# Altium schematic sheet LPEDT_revA1_bikeit_MCU_PINS.SchDoc: MCU I/O Port Pins
size A3; Author: Dhruva Koley; DocumentNumber: 8; Revision: 1; SheetNumber: 7; SheetTotal: 11
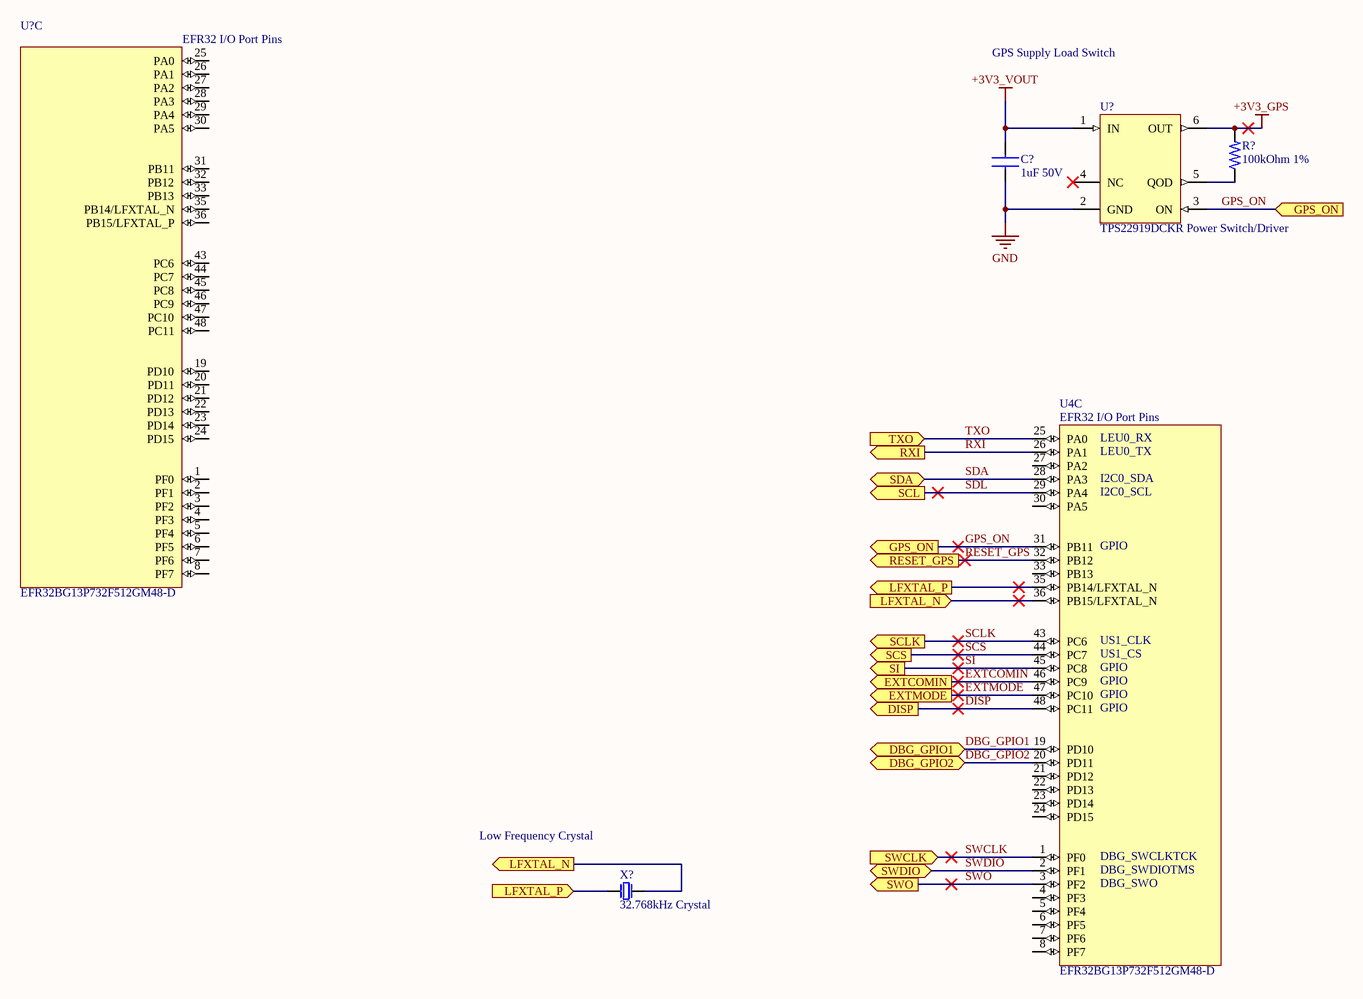
[diagram p0: LPEDT_revA1_bikeit_MCU_PINS.SchDoc]

## Parts
(Parts that share a designator on the sheet are numbered #1, #2 ... from top to bottom, then left to right.)
C?  1uF 50V  [CAP_0603_1.60mm*0.80mm]
R?  100kOhm 1%  [RES_0603_1608X06]
U4  EFR32BG13P732F512GM48-D  [QFN50P700X700X90_HS-49N]  (part C of 3)
U?#1  TPS22919DCKR Power Switch/Driver
U?#2  EFR32BG13P732F512GM48-D  [QFN50P700X700X90_HS-49N]  (part C of 3)
X?  32.768kHz Crystal

## Ports
DBG_GPIO1 (bidir), DBG_GPIO2 (bidir), DISP (out), EXTCOMIN (out), EXTMODE (out), GPS_ON (in), GPS_ON (out), LFXTAL_N (in), LFXTAL_N (out), LFXTAL_P (in), LFXTAL_P (out), RESET_GPS (out), RXI (out), SCL (out), SCLK (out), SCS (out), SDA (bidir), SI (out), SWCLK (in), SWDIO (bidir), SWO (out), TXO (in)

## Nets
+3V3_GPS: R?.2 U?#1.6(OUT)
+3V3_VOUT: C?.1 U?#1.1(IN)
GND: C?.2 U?#1.2(GND)
DBG_GPIO1: U4.19(PD10) ; port DBG_GPIO1
DBG_GPIO2: U4.20(PD11) ; port DBG_GPIO2
DISP: U4.48(PC11) ; port DISP
EXTCOMIN: U4.46(PC9) ; port EXTCOMIN
EXTMODE: U4.47(PC10) ; port EXTMODE
GPS_ON: U4.31(PB11) U?#1.3(ON) ; port GPS_ON
LFXTAL_N: U4.36(PB15/LFXTAL_N) X?.2 ; port LFXTAL_N
LFXTAL_P: U4.35(PB14/LFXTAL_N) X?.1 ; port LFXTAL_P
RESET_GPS: U4.32(PB12) ; port RESET_GPS
RXI: U4.26(PA1) ; port RXI
SCLK: U4.43(PC6) ; port SCLK
SCS: U4.44(PC7) ; port SCS
SDA: U4.28(PA3) ; port SDA
SDL: U4.29(PA4) ; port SCL
SI: U4.45(PC8) ; port SI
SWCLK: U4.1(PF0) ; port SWCLK
SWDIO: U4.2(PF1) ; port SWDIO
SWO: U4.3(PF2) ; port SWO
TXO: U4.25(PA0) ; port TXO
NetR?_1: R?.1 U?#1.5(QOD)

Not connected (* = marked no-connect by the designer): U4 4(PF3) 5(PF4) 6(PF5) 7(PF6) 8(PF7) 21(PD12) 22(PD13) 23(PD14) 24(PD15) 27(PA2) 30(PA5) 33(PB13); U?#1 4(NC)*; U?#2 1(PF0) 2(PF1) 3(PF2) 4(PF3) 5(PF4) 6(PF5) 7(PF6) 8(PF7) 19(PD10) 20(PD11) 21(PD12) 22(PD13) 23(PD14) 24(PD15) 25(PA0) 26(PA1) 27(PA2) 28(PA3) 29(PA4) 30(PA5) 31(PB11) 32(PB12) 33(PB13) 35(PB14/LFXTAL_N) 36(PB15/LFXTAL_P) 43(PC6) 44(PC7) 45(PC8) 46(PC9) 47(PC10) 48(PC11)

## Notes on the sheet
- GPS Supply Load Switch
- (near U4) LEU0_RX
- (near U4) LEU0_TX
- (near U4) I2C0_SDA
- (near U4) I2C0_SCL
- (near U4) GPIO
- (near U4) US1_CLK
- (near U4) US1_CS
- (near X?) Low Frequency Crystal
- (near U4) DBG_SWCLKTCK
- (near U4) DBG_SWDIOTMS
- (near U4) DBG_SWO
- (in symbol EFR32BG13P732F512GM48-D, part C) EFR32 I/O Port Pins

## Library data of the parts
C? = GRT188R61H105KE13D: CAP, MLCC, AEC-Q200, X5R, 1uF, 50V, 0603; Manufacturer: Murata; Tolerance: 10%; Supplier 1: Digi-Key; Manufacturer Part Number: GRT188R61H105KE13D; RoHS: Yes; Category: Ceramic Capacitors; Stock 1: 645268; Pricing 1: 1=0.26000, 10=0.17900, 50=0.10720, 100=0.09060, 500=0.06198, 1000=0.05483 (USD); Mount: Surface Mount; Case/Package: 0603; Case Code (Metric): 1608; Case Code (Imperial): 0603; Min Operating Temperature: -55°C; Max Operating Temperature: 85°C; Packaging: Tape and Reel; Capacitance: 1uF; Voltage Rating: 50V; Dielectric: X5R; Voltage Rating (DC): 50V; Length: 0.063inch; Width: 0.031inch; Thickness: 0.035inch; Ratings: AEC-Q200; RoHS Compliant: Yes; ComponentLink1URL: http://www.farnell.com/datasheets/2165959.pdf?src-supplier=Farnell; ComponentLink1Description: http://www.farnell.com/datasheets/2165959.pdf?src-supplier=Farnell; ComponentLink2URL: http://search.murata.co.jp/Ceramy/image/img/A01X/G101/ENG/GRT188R61H105KE13-01.pdf?src-supplier=Digi-Key; ComponentLink2Description: http://search.murata.co.jp/Ceramy/image/img/A01X/G101/ENG/GRT188R61H105KE13-01.pdf?src-supplier=Digi-Key; ComponentLink3URL: https://search.murata.co.jp/Ceramy/image/img/A01X/G101/ENG/GRT188R61H105KE13-01.pdf?src-supplier=Digi-Key; ComponentLink3Description: https://search.murata.co.jp/Ceramy/image/img/A01X/G101/ENG/GRT188R61H105KE13-01.pdf?src-supplier=Digi-Key; ComponentLink4URL: http://www.farnell.com/datasheets/2165959.pdf?src-supplier=Newark; ComponentLink4Description: http://www.farnell.com/datasheets/2165959.pdf?src-supplier=Newark; Supplier Part Number 1: 490-12330-1-ND
R? = RC0603FR-07100KL: RES SMD 100k  1% 1/10W 0603; Manufacturer: Yageo; Resistance: 100kR; Temperature Coefficient: 100ppm/°C; Voltage Rating (DC): 50V; Power Rating: 100mW; Working Voltage: 75V; Supplier 1: Digi-Key; Manufacturer Part Number: RC0603FR-07100KL; RoHS: Yes; Category: Chip SMD Resistors; Stock 1: 21765991; Pricing 1: 1=0.10000, 10=0.02300, 100=0.00930, 1000=0.00417, 2500=0.00362 (USD); Case/Package: 0603; Number of Pins: 2; Case Code (Imperial): 0603; Case Code (Metric): 1608; Min Operating Temperature: -55°C; Max Operating Temperature: 155°C; Tolerance: 1%; Packaging: Tape and Reel; Resistor Type: Thick Film; Voltage Rating: 50V; Termination: SMD/SMT; Number of Terminations: 2; Features: Moisture Resistant; Series: RC; Max Power Dissipation: 100mW; Resistance Tolerance: 1%; Construction: Rectangular; Technology: THICK FILM; Length: 1.6mm; Width: 0.8mm; Height: 0.45mm; Depth: 0.8mm; REACH SVHC: No SVHC; Lead Free: Lead Free; Military Standard: Not; RoHS Compliant: Yes; ComponentLink1URL: https://datasheet.ciiva.com/11808/0900766b80f96399-11808107.pdf?src-supplier=RSComponents; ComponentLink1Description: https://datasheet.ciiva.com/11808/0900766b80f96399-11808107.pdf?src-supplier=RSComponents; ComponentLink2URL: https://datasheet.ciiva.com/46440/1868787-46440889.pdf?src-supplier=Element14; ComponentLink2Description: https://datasheet.ciiva.com/46440/1868787-46440889.pdf?src-supplier=Element14; ComponentLink3URL: https://datasheet.ciiva.com/7746/1738695-7746234.pdf?src-supplier=Element14; ComponentLink3Description: https://datasheet.ciiva.com/7746/1738695-7746234.pdf?src-supplier=Element14; ComponentLink4URL: https://datasheet.ciiva.com/7983/443971-7983593.pdf?src-supplier=Element14; ComponentLink4Description: https://datasheet.ciiva.com/7983/443971-7983593.pdf?src-supplier=Element14; ComponentLink5URL: https://datasheet.ciiva.com/7746/1738695-7746235.pdf?src-supplier=Element14; ComponentLink5Description: https://datasheet.ciiva.com/7746/1738695-7746235.pdf?src-supplier=Element14; ComponentLink6URL: https://datasheet.ciiva.com/22747/443971-22747516.pdf?src-supplier=Element14; ComponentLink6Description: https://datasheet.ciiva.com/22747/443971-22747516.pdf?src-supplier=Element14; Supplier Part Number 1: 311-100KHRCT-ND
U4 U?#2 = EFR32BG13P732F512GM48-D: BLUE GECKO QFN48 2.4 GHZ 512KB 6; Manufacturer: Silicon Labs; Supplier 1: Digi-Key; Manufacturer Part Number: EFR32BG13P732F512GM48-D; RoHS: No; Category: RF Receivers, Transceivers; Pricing 1: 1=7.61000, 10=6.79200, 25=6.11320, 80=5.56988, 230=5.02643, 440=4.51023, 945=3.80380 (USD); ComponentLink1URL: http://www.farnell.com/datasheets/2813683.pdf?src-supplier=Farnell; ComponentLink1Description: http://www.farnell.com/datasheets/2813683.pdf?src-supplier=Farnell; Supplier Part Number 1: 336-5922-ND
U?#1 = TPS22919DCKR: 5.5-V, 1.5-A, 90-mΩ load switch with adj. output discharge 6-SC70 -40 to 105; Manufacturer: Texas Instruments; Supplier 1: Digi-Key; Manufacturer Part Number: TPS22919DCKR; RoHS: Yes; Stock 1: 68518; Pricing 1: 1=0.39000, 10=0.29100, 25=0.26240, 100=0.14310, 250=0.13832, 500=0.12402, 1000=0.09540 (USD); RoHS Compliant: Yes; Supplier Part Number 1: 296-TPS22919DCKRCT-ND
X? = CM8V-T1A-32.768KHZ-12.5PF-20PPM-TB-QA: 32.768kHz ±20ppm Crystal 12.5pF 70 kOhms 2-SMD, No Lead; Manufacturer: Micro Crystal; Supplier 1: Digi-Key; Manufacturer Part Number: CM8V-T1A-32.768KHZ-12.5PF-20PPM-TB-QA; RoHS: No; Stock 1: 2694; Pricing 1: 1=0.77000, 10=0.63800, 50=0.57400, 100=0.51030, 500=0.48478 (USD); Supplier Part Number 1: 2195-CM8V-T1A-32.768KHZ-12.5PF-20PPM-TB-QACT-ND